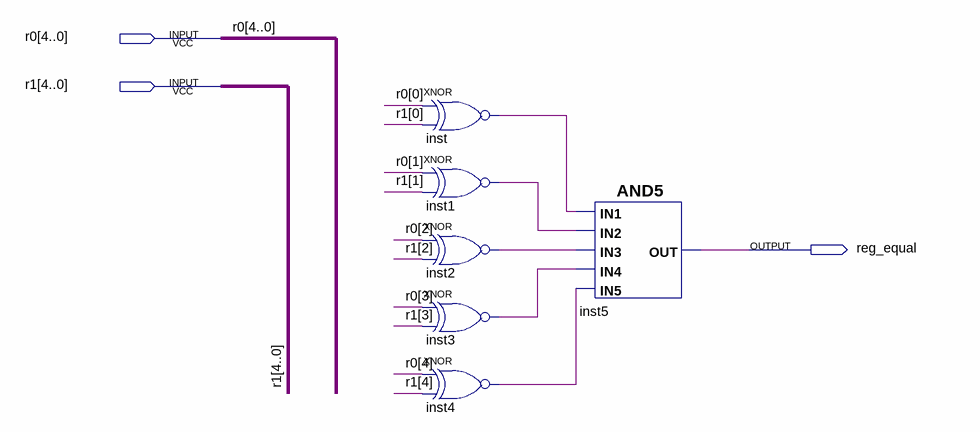
[diagram p0: schematic sheet]
// Quartus schematic reg_equal.bdf as structural Verilog: 6 symbols, 3 pins
module reg_equal (
  input  [4:0] r0,
  input  [4:0] r1,
  output reg_equal
);

  wire inst1_out, inst2_out, inst3_out, inst4_out, inst_out;

  xnor inst (inst_out, r0[0], r1[0]);
  xnor inst1 (inst1_out, r0[1], r1[1]);
  xnor inst2 (inst2_out, r0[2], r1[2]);
  xnor inst3 (inst3_out, r0[3], r1[3]);
  xnor inst4 (inst4_out, r0[4], r1[4]);
  and inst5 (reg_equal, inst_out, inst1_out, inst2_out, inst3_out, inst4_out);
endmodule
